# Altium project A Power Regulator and LED Board.PrjPcb
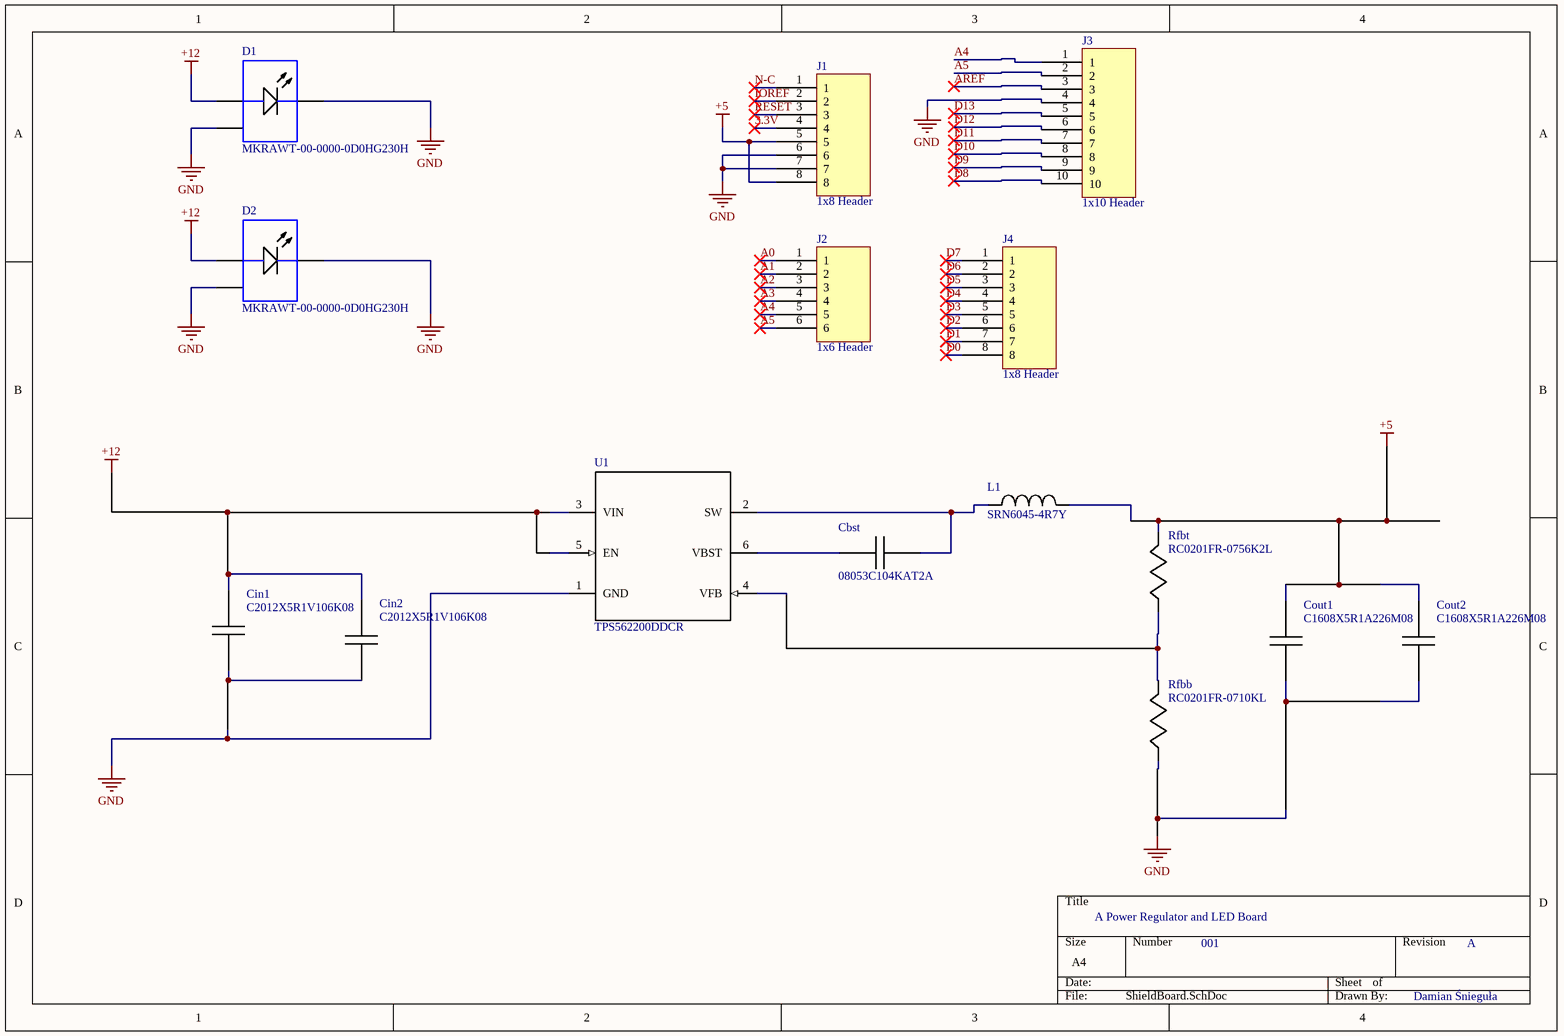
[diagram p0: ShieldBoard.SchDoc]
1 sheet, 15 parts. Net scope: global (net labels, ports and power ports of the same name join across sheets).
Board file: ShieldBoard.PcbDoc

## Sheet ShieldBoard.SchDoc
size A4; SheetNumber: 1; SheetTotal: 1

### Parts
Cbst  08053C104KAT2A  [0805]
Cin1  C2012X5R1V106K08  [0805]
Cin2  C2012X5R1V106K08  [0805]
Cout1  C1608X5R1A226M08  [0603]
Cout2  C1608X5R1A226M08  [0603]
D1  MKRAWT-00-0000-0D0HG230H  [CREE-MK-R-2_V]
D2  MKRAWT-00-0000-0D0HG230H  [CREE-MK-R-2_V]
J1  1x8 Header  [PCBComponent_2]
J2  1x6 Header  [PCBComponent_1]
J3  1x10 Header  [PCBComponent_3]
J4  1x8 Header  [PCBComponent_2]
L1  SRN6045-4R7Y  [SRN6045]
Rfbb  RC0201FR-0710KL  [0201]
Rfbt  RC0201FR-0756K2L  [0201]
U1  TPS562200DDCR  [DDC0006A]

### Nets
+5: Cout1.1 Cout2.1 J1.5 J1.8 L1.2 Rfbt.1
+12: Cin1.1 Cin2.1 D1.1(A) D2.1(A) U1.3(VIN) U1.5(EN)
GND: Cin1.2 Cin2.2 Cout1.2 Cout2.2 D1.2(K) D1.3(EP) D2.2(K) D2.3(EP) J1.6 J1.7 J3.4 Rfbb.2 U1.1(GND)
3.3V: J1.4
A0: J2.1
A1: J2.2
A2: J2.3
A3: J2.4
A4: J2.5 J3.1
A5: J2.6 J3.2
AREF: J3.3
D0: J4.8
D1: J4.7
D2: J4.6
D3: J4.5
D4: J4.4
D5: J4.3
D6: J4.2
D7: J4.1
D8: J3.10
D9: J3.9
D10: J3.8
D11: J3.7
D12: J3.6
D13: J3.5
IOREF: J1.2
N-C: J1.1
RESET: J1.3
NetCbst_1: Cbst.1 L1.1 U1.2(SW)
NetCbst_2: Cbst.2 U1.6(VBST)
NetRfbb_1: Rfbb.1 Rfbt.2 U1.4(VFB)

### Notes on the sheet
- A Power Regulator and LED Board
- 001
- A
- Damian Śnieguła

### Library data of the parts
Cbst = 08053C104KAT2A: No Description Available; Vendor: AVX; Manufacturer_Part_Number: 08053C104KAT2A; Copyright: Copyright (C) 2018 Accelerated Designs. All rights reserved; RefDes: RefDes; TYPE: TYPE; Value: Value
Cin1 Cin2 = C2012X5R1V106K08: No Description Available; Manufacturer_Part_Number: C2012X5R1V106K085AC; Vendor: TDK; Copyright: Copyright (C) 2018 Accelerated Designs. All rights reserved; RefDes: RefDes; TYPE: TYPE; Value: Value
Cout1 Cout2 = C1608X5R1A226M08: No Description Available; Manufacturer_Part_Number: C1608X5R1A226M080AC; Vendor: TDK; Copyright: Copyright (C) 2018 Accelerated Designs. All rights reserved; RefDes: RefDes; TYPE: TYPE; Value: Value
D1 D2 = CMP-2100-00980-1: LED, White, 12 V, 2-Pin SMD, RoHS, Tape and Reel
J1 J4 = 8-Pin-Header: Manufacturer Part Number: SSQ-108-03-T-S
J2 = 6-Pin-Header: Manufacturer Part Number: SSQ-106-03-T-S
J3 = 10-Pin-Header: Manufacturer Part Number: SSQ-110-03-T-S
L1 = SRN6045-4R7Y: No Description Available; Vendor: Bourns; Manufacturer_Part_Number: SRN6045-4R7Y; Copyright: Copyright (C) 2018 Accelerated Designs. All rights reserved; RefDes: RefDes; TYPE: TYPE; Value: Value
Rfbb = RC0201FR-0710KL: No Description Available; Vendor: Yageo America; Manufacturer_Part_Number: RC0201FR-0710KL; Copyright: Copyright (C) 2018 Accelerated Designs. All rights reserved; RefDes: RefDes; TYPE: TYPE; Value: Value
Rfbt = RC0201FR-0756K2L: No Description Available; Vendor: Yageo America; Manufacturer_Part_Number: RC0201FR-0756K2L; Copyright: Copyright (C) 2018 Accelerated Designs. All rights reserved; RefDes: RefDes; TYPE: TYPE; Value: Value
U1 = TPS562200DDCR: No Description Available; Alternate_Manufacturer: None; Manufacturer: Texas Instruments; CurrentTime: Not shown in title block; DocumentNumber: 1; SymbolCreator: a0411947; CompType: IC; U/M: EA; Designator: U?; PIN_COUNT: 6; CurrentDate: Not shown in title block; Time: Not shown in title block; Date: Not shown in title block; DocumentFullPathAndName: Not shown in title block; DocumentName: Not shown in title block; ModifiedDate: Not shown in title block; ApprovedBy: Not shown in title block; CheckedBy: Not shown in title block; Author: Not shown in title block; CompanyName: Not shown in title block; Engineer: Not shown in title block; Organization: Not shown in title block; Address1: Not shown in title block; Address2: Not shown in title block; Address3: Not shown in title block; Address4: Not shown in title block; Revision: Use project parameter SCH_Rev; SheetNumber: 1; SheetTotal: 1; ImagePath: Not shown in title block; Rule: *; ProjectName: *; SymbolVersion: 2013-09-26; PartNumber: TPS562200DDC; PackageReference: DDC0006A; MountType: SMT; ComponentLink1Description: Datasheet Link; ComponentLink1URL: https://sps06.itg.ti.com/sites/KMS/crossdivteams/altium/docs/ComponentDatasheets/TPS562200_DS_v08_13_0909.docx; RoHS: Y; Publisher: Texas Instruments; LatestRevisionDate: 2014-02-20; Copyright: Copyright (C) 2018 Accelerated Designs. All rights reserved; Refdes: Refdes; Type: Type; Value: Value